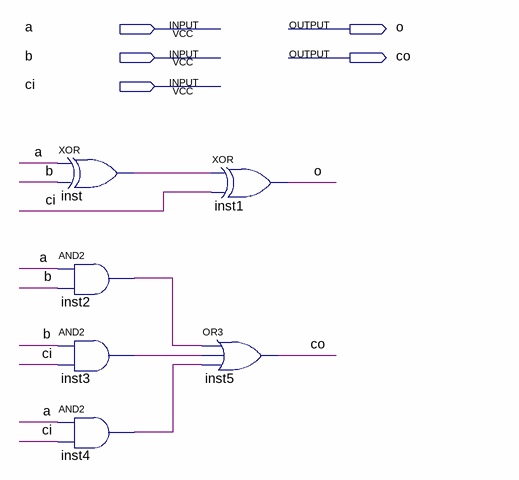
[diagram p0: schematic sheet]
// Quartus schematic Add1.bdf as structural Verilog: 6 symbols, 5 pins
module Add1 (
  input  a,
  input  b,
  input  ci,
  output o,
  output co
);

  wire inst2_out, inst3_out, inst4_out, inst_out;

  xor inst (inst_out, a, b);
  and inst2 (inst2_out, a, b);
  and inst3 (inst3_out, b, ci);
  and inst4 (inst4_out, a, ci);
  xor inst1 (o, inst_out, ci);
  or inst5 (co, inst2_out, inst3_out, inst4_out);
endmodule
